# EAGLE design Aux_Power_Board (EAGLE 8.6.3)

## Sheet 1 of 2
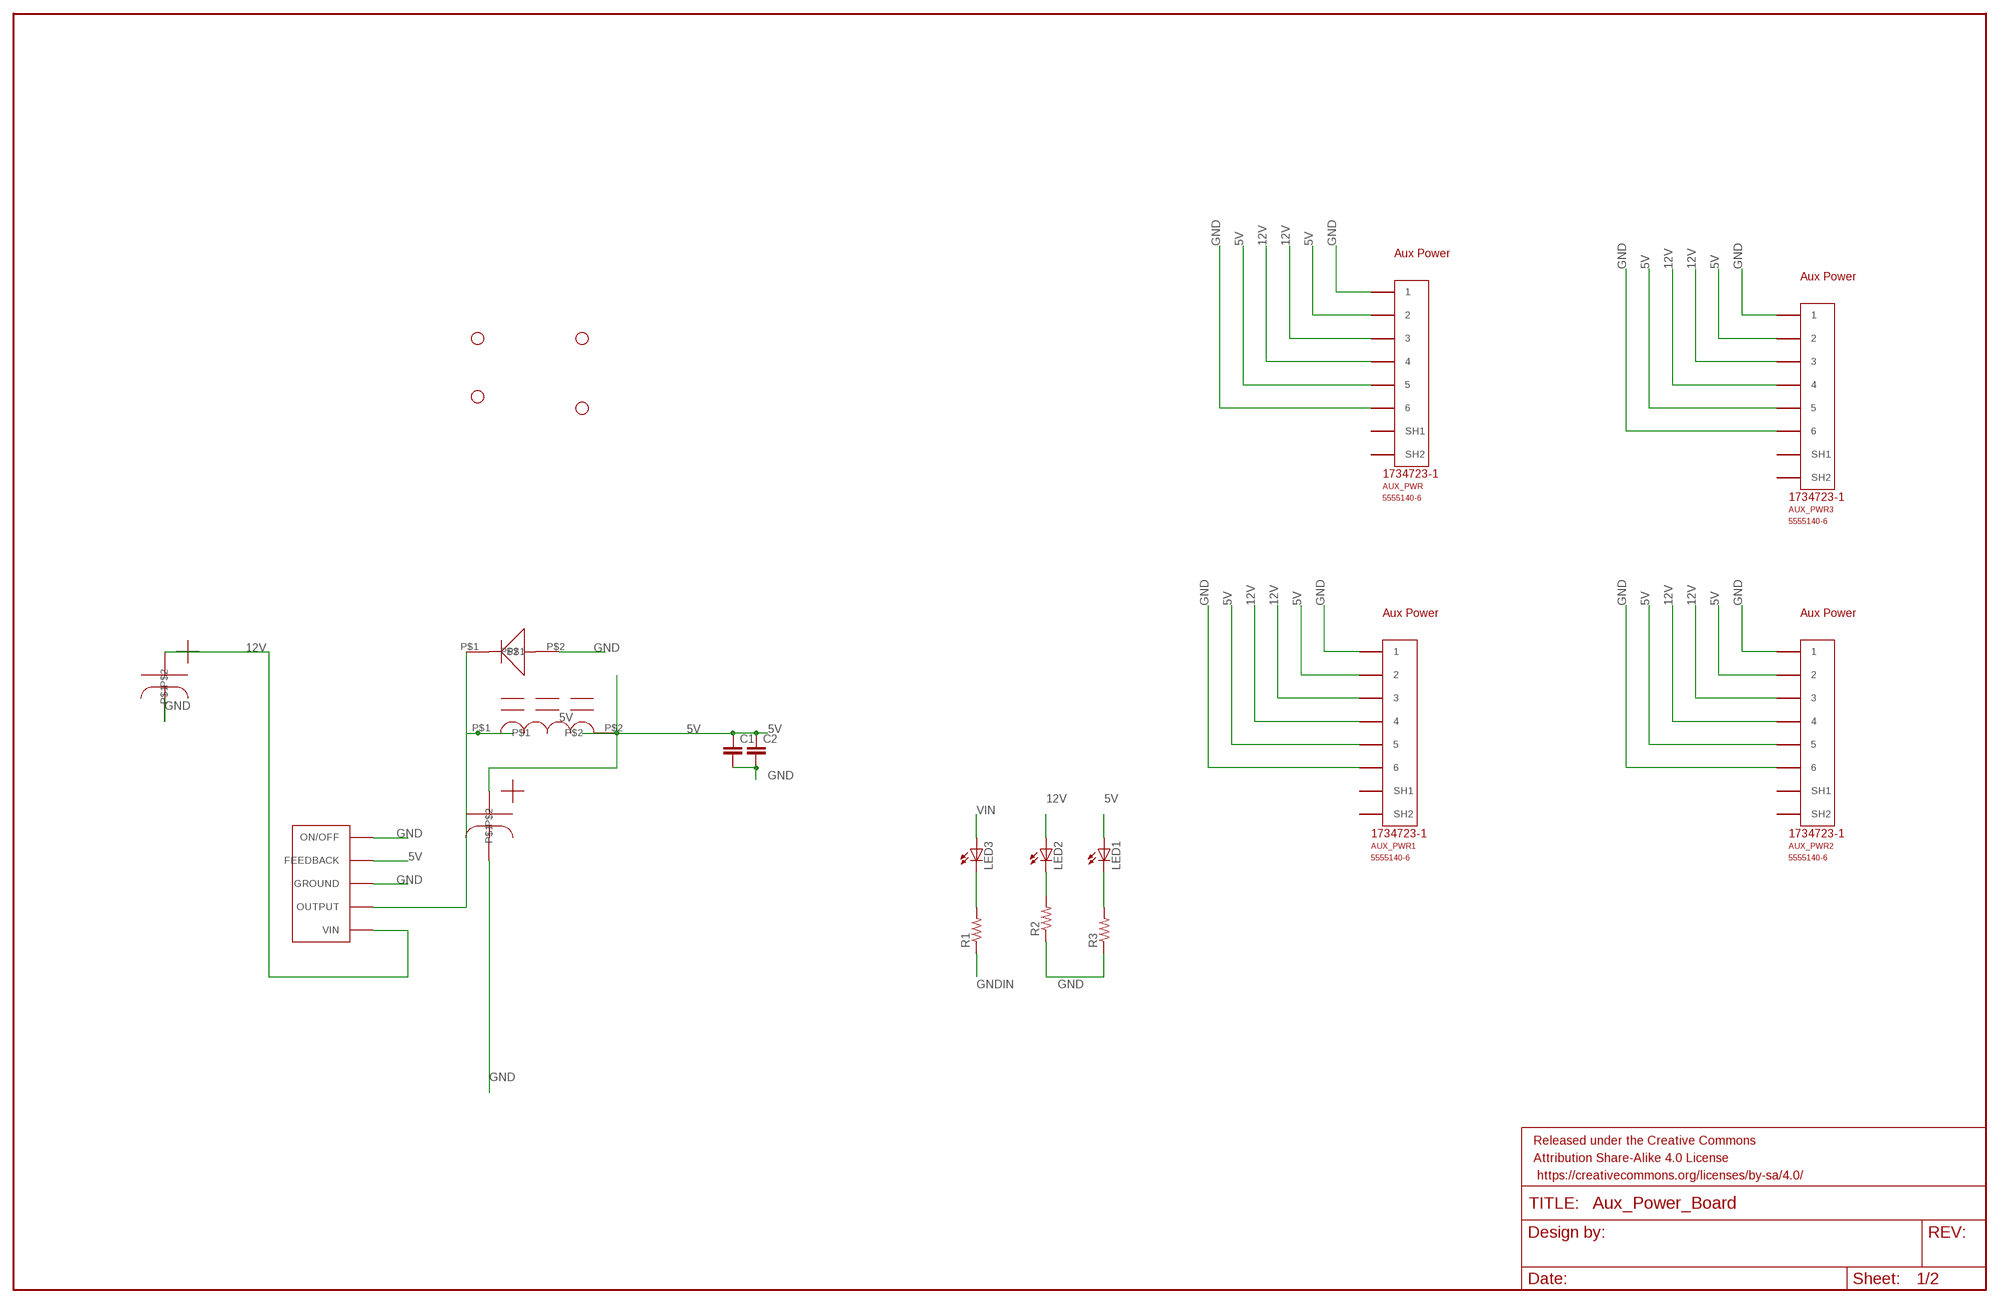
[diagram p0: schematic, sheet 1]

### Parts
AUX_PWR  5555140-6  [1734723-1_RJ11]
AUX_PWR1  5555140-6  [1734723-1_RJ11]
AUX_PWR2  5555140-6  [1734723-1_RJ11]
AUX_PWR3  5555140-6  [1734723-1_RJ11]
C1  CAP0805  [0805]
C2  CAP0805  [0805]
FRAME1  FRAME-LEDGER  [CREATIVE_COMMONS]
H1  STAND-OFF  [STAND-OFF]
H2  STAND-OFF  [STAND-OFF]
H3  STAND-OFF  [STAND-OFF]
H4  STAND-OFF  [STAND-OFF]
LED1  LEDCHIP-LED0805  [CHIP-LED0805]
LED2  LEDCHIP-LED0805  [CHIP-LED0805]
LED3  LEDCHIP-LED0805  [CHIP-LED0805]
R1  R-US_M0805  [M0805]
R2  R-US_M0805  [M0805]
R3  R-US_M0805  [M0805]
U$4  MBR360GOS  [MBR360GOS]
U$7  LM2576  [D2PAK-5]
U$8  CAPESK107M025AC3AA  [ESK107M025AC3AA]
U$9  CAPESK108M025AH4EA  [ESK108M025AH4EA]
U$10  M1418-ND  [M1418-ND]

### Nets
5V: AUX_PWR1.2 AUX_PWR1.5 AUX_PWR2.2 AUX_PWR2.5 AUX_PWR3.2 AUX_PWR3.5 AUX_PWR.2 AUX_PWR.5 C1.1 C2.1 LED1.A U$7.4(FEEDBACK) U$9.P$1 U$10.P$2 ; also sheet 2
12V: AUX_PWR1.3 AUX_PWR1.4 AUX_PWR2.3 AUX_PWR2.4 AUX_PWR3.3 AUX_PWR3.4 AUX_PWR.3 AUX_PWR.4 LED2.A U$7.1(VIN) U$8.P$1 ; also sheet 2
GND: AUX_PWR1.1 AUX_PWR1.6 AUX_PWR2.1 AUX_PWR2.6 AUX_PWR3.1 AUX_PWR3.6 AUX_PWR.1 AUX_PWR.6 C1.2 C2.2 R2.1 R3.1 U$4.P$2 U$7.3(GROUND) U$7.5(ON/OFF) U$7.GROUND U$8.P$2 U$9.P$2 ; also sheet 2
GNDIN: R1.1 ; also sheet 2
N$1: U$4.P$1 U$7.2(OUTPUT) U$10.P$1
N$3: LED3.C R1.2
N$6: LED2.C R2.2
N$9: LED1.C R3.2
VIN: LED3.A ; also sheet 2
Unconnected: AUX_PWR1.SH1 AUX_PWR1.SH2 AUX_PWR2.SH1 AUX_PWR2.SH2 AUX_PWR3.SH1 AUX_PWR3.SH2 AUX_PWR.SH1 AUX_PWR.SH2

### Notes on the sheet
- Aux Power
- Aux Power
- Aux Power | Aux Power

## Sheet 2 of 2
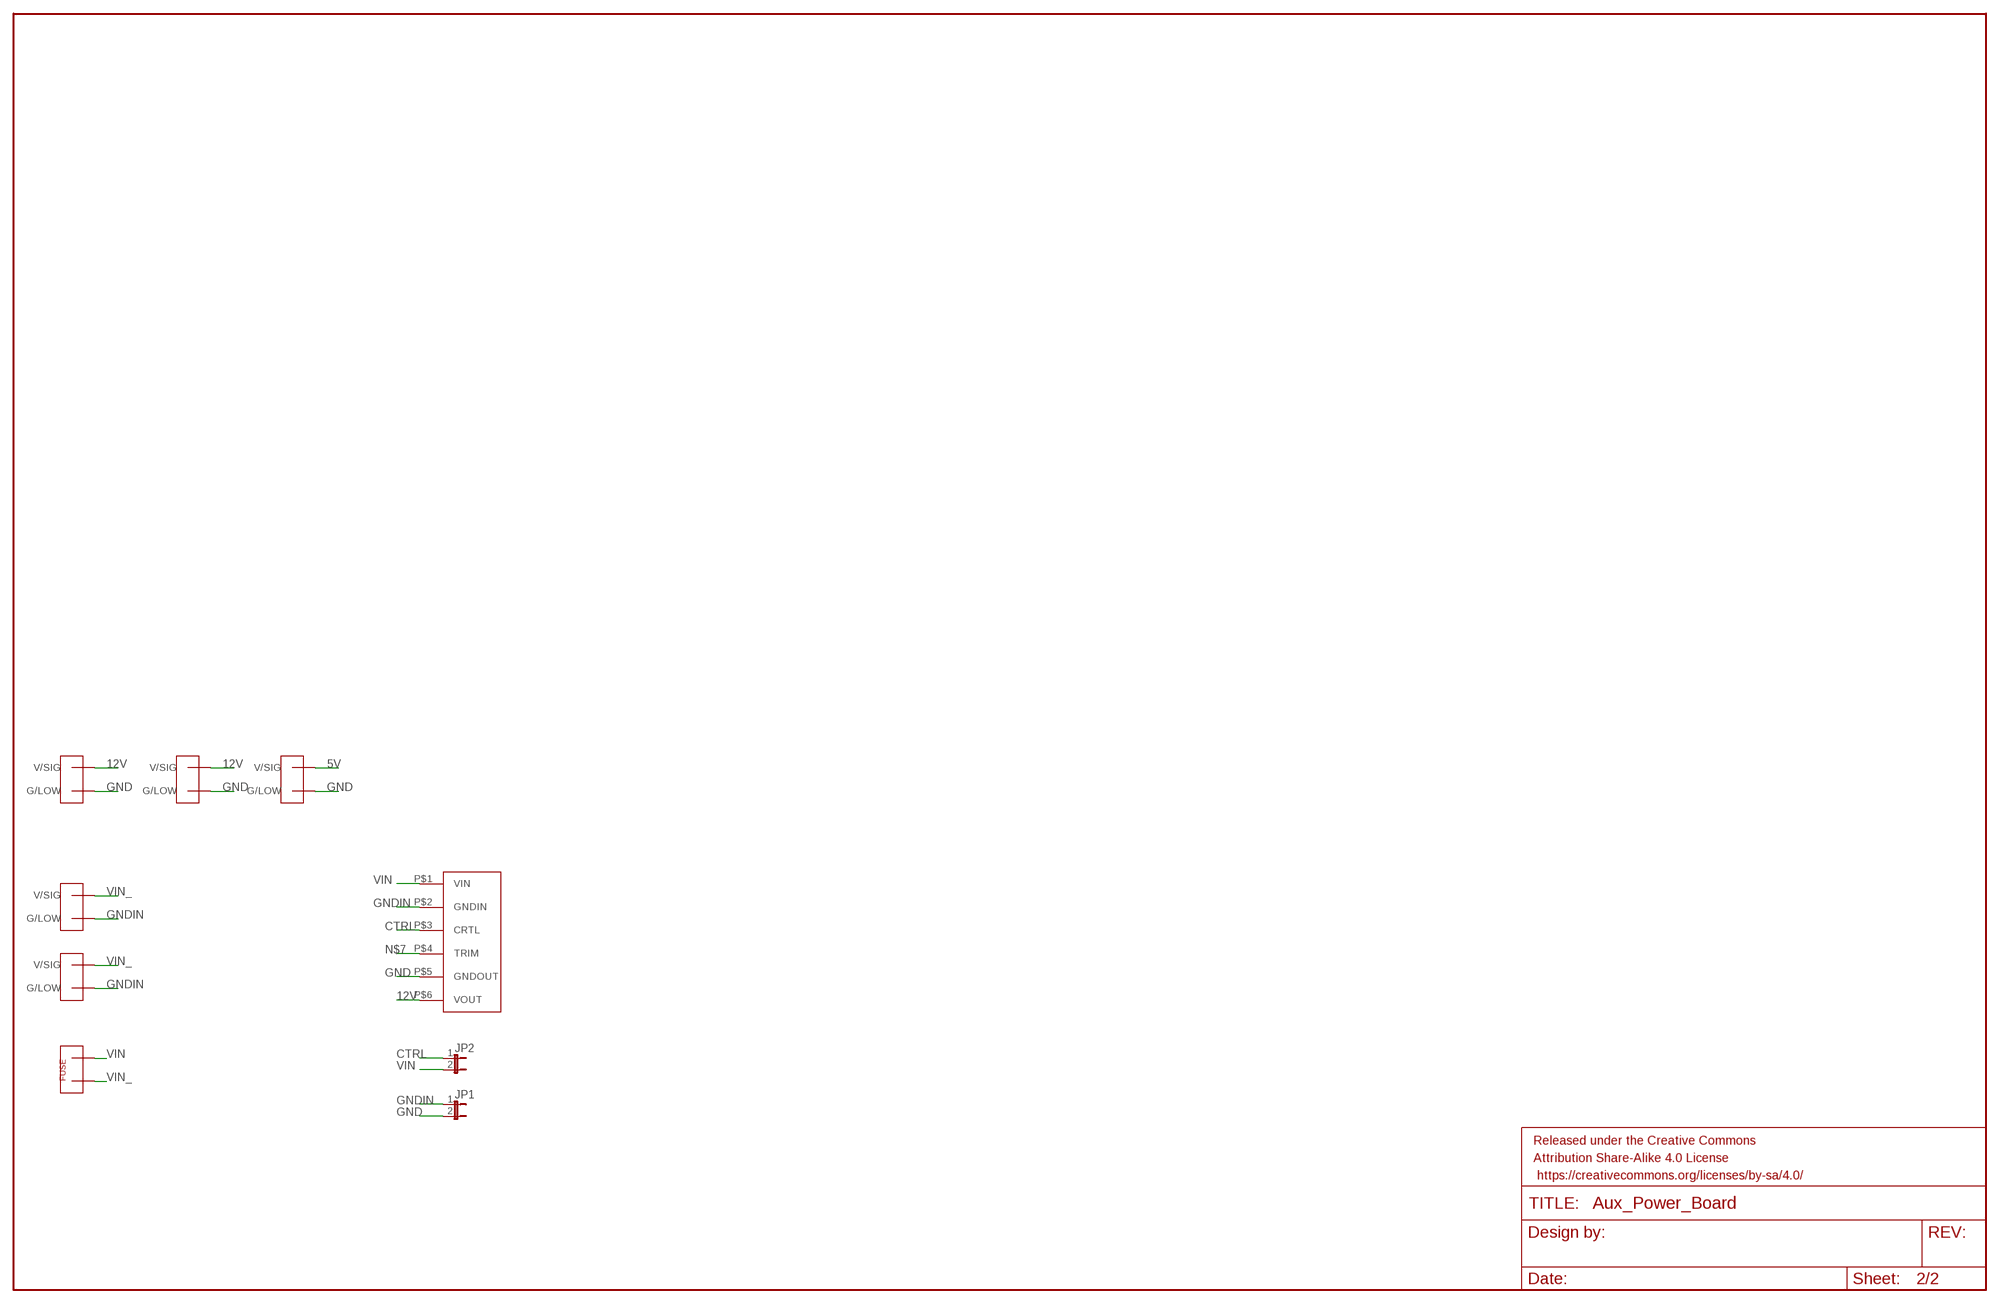
[diagram p1: schematic, sheet 2]

### Parts
FRAME2  FRAME-LEDGER  [CREATIVE_COMMONS]
JP1  JP1E  [JP1]
JP2  JP1E  [JP1]
U$1  TE770966  [2X1-MATE-N-LOCK]
U$2  TE770966  [2X1-MATE-N-LOCK]
U$3  TE770966  [2X1-MATE-N-LOCK]
U$12  RPA60-2412SFW_P  [RPA60-2412SFW/P]
U$13  FUSEMINI-BLADE  [MINI-BLADE-FUSE]
U$14  TE770966  [2X1-MATE-N-LOCK]
U$15  TE770966  [2X1-MATE-N-LOCK]

### Nets
5V: U$3.CIRCUIT1(V/SIG) ; also sheet 1
12V: U$1.CIRCUIT1(V/SIG) U$2.CIRCUIT1(V/SIG) U$12.P$6(VOUT) ; also sheet 1
CTRL: JP2.1 U$12.P$3(CRTL)
GND: JP1.2 U$1.CIRCUIT2(G/LOW) U$2.CIRCUIT2(G/LOW) U$3.CIRCUIT2(G/LOW) U$12.P$5(GNDOUT) ; also sheet 1
GNDIN: JP1.1 U$12.P$2(GNDIN) U$14.CIRCUIT2(G/LOW) U$15.CIRCUIT2(G/LOW) ; also sheet 1
N$7: U$12.P$4(TRIM)
VIN: JP2.2 U$12.P$1(VIN) U$13.OUT ; also sheet 1
VIN_: U$13.IN U$14.CIRCUIT1(V/SIG) U$15.CIRCUIT1(V/SIG)

## Library data of the parts
AUX_PWR AUX_PWR1-AUX_PWR3 = 5555140-6 RJ11:5555140-6
C1 C2 = E-P-099-R2.2:CAP: Capacitor Standard 0603 ceramic capacitor, and 0.1" leaded capacitor.
FRAME1 FRAME2 = SparkFun-Aesthetics:FRAME-LEDGER: Schematic Frame - Ledger Standard 11x14 US Ledger frame
H1-H4 = SparkFun-Electromechanical:STAND-OFF: #4 Stand Off This is the mechanical footprint for a #4 phillips button head screw. Use the keepout ring to avoid running the screw head into surrounding components. SKU : PRT-00447
JP1 JP2 = jumper:JP1E: JUMPER
LED1-LED3 = led:LED: LED OSRAM: - CHIPLED LG R971, LG N971, LY N971, LG Q971, LY Q971, LO R971, LY R971 LH N974, LH R974 LS Q976, LO Q976, LY Q976 LO Q996 - Hyper CHIPLED LW Q18S LB Q993, LB Q99A, LB R99A - SideLED LS A670, LO A670, LY A670, LG A670, LP A670 LB A673, LV A673, LT A673, LW A673 LH A674 LY A675 LS A676, LA A676, LO A676, LY A676, LW A676 LS A679, LY A679, LG A679 - Hyper Micro SIDELED® LS Y876, LA Y876, LO Y876, LY Y876 LT Y87S - SmartLED LW L88C, LW L88S LB L89C, LB L89S, LG L890 LS L89K, LO L89K, LY L89K LS L896, LA L896, LO L896, LY L896 - TOPLED LS T670, LO T670, LY T670, LG T670, LP T670 LSG T670, LSP T670, LSY T670, LOP T670, LYG T670 LG T671, LOG T671, LSG T671 LB T673, LV T673, LT T673, LW T673 LH T674 LS T676, LA T676, LO T676, LY T676, LB T676, LH T676, LSB T676, LW T676 LB T67C, LV T67C, LT T67C, LS T67K, LO T67K, LY T67K, LW E67C LS E67B, LA E67B, LO E67B, LY E67B, LB E67C, LV E67C, LT E67C LW T67C LS T679, LY T679, LG T679 LS T770, LO T770, LY T770, LG T770, LP T770 LB T773, LV T773, LT T773, LW T773 LH T774 LS E675, LA E675, LY E675, LS T675 LS T776, LA T776, LO T776, LY T776, LB T776 LHGB T686 LT T68C, LB T68C - Hyper Mini TOPLED® LB M676 - Mini TOPLED Santana® LG M470 LS M47K, LO M47K, LY M47K Source: http://www.osram.convergy.de LUXEON: - LUMILED® LXK2-PW12-R00, LXK2-PW12-S00, LXK2-PW14-U00, LXK2-PW14-V00 LXK2-PM12-R00, LXK2-PM12-S00, LXK2-PM14-U00 LXK2-PE12-Q00, LXK2-PE12-R00, LXK2-PE12-S00, LXK2-PE14-T00, LXK2-PE14-U00 LXK2-PB12-K00, LXK2-PB12-L00, LXK2-PB12-M00, LXK2-PB14-N00, LXK2-PB14-P00, LXK2-PB14-Q00 LXK2-PR12-L00, LXK2-PR12-M00, LXK2-PR14-Q00, LXK2-PR14-R00 LXK2-PD12-Q00, LXK2-PD12-R00, LXK2-PD12-S00 LXK2-PH12-R00, LXK2-PH12-S00 LXK2-PL12-P00, LXK2-PL12-Q00, LXK2-PL12-R00 Source: www.luxeon.com KINGBRIGHT: KA-3528ASYC Source: www.kingbright.com
R1-R3 = rcl:R-US_: RESISTOR, American symbol; SPICEPREFIX: R
U$1-U$3 U$14 U$15 = Shell2013(1):TE770966
U$4 = Shell2013:MBR360GOS
U$7 = Shell2015:LM2576
U$8 U$9 = Shell2015:CAP
U$10 = Shell2015:M1418-ND: 100uF inductor
U$12 = RPA60-2412SFW_P:RPA60-2412SFW_P
U$13 = Shell2013:FUSE

## Board
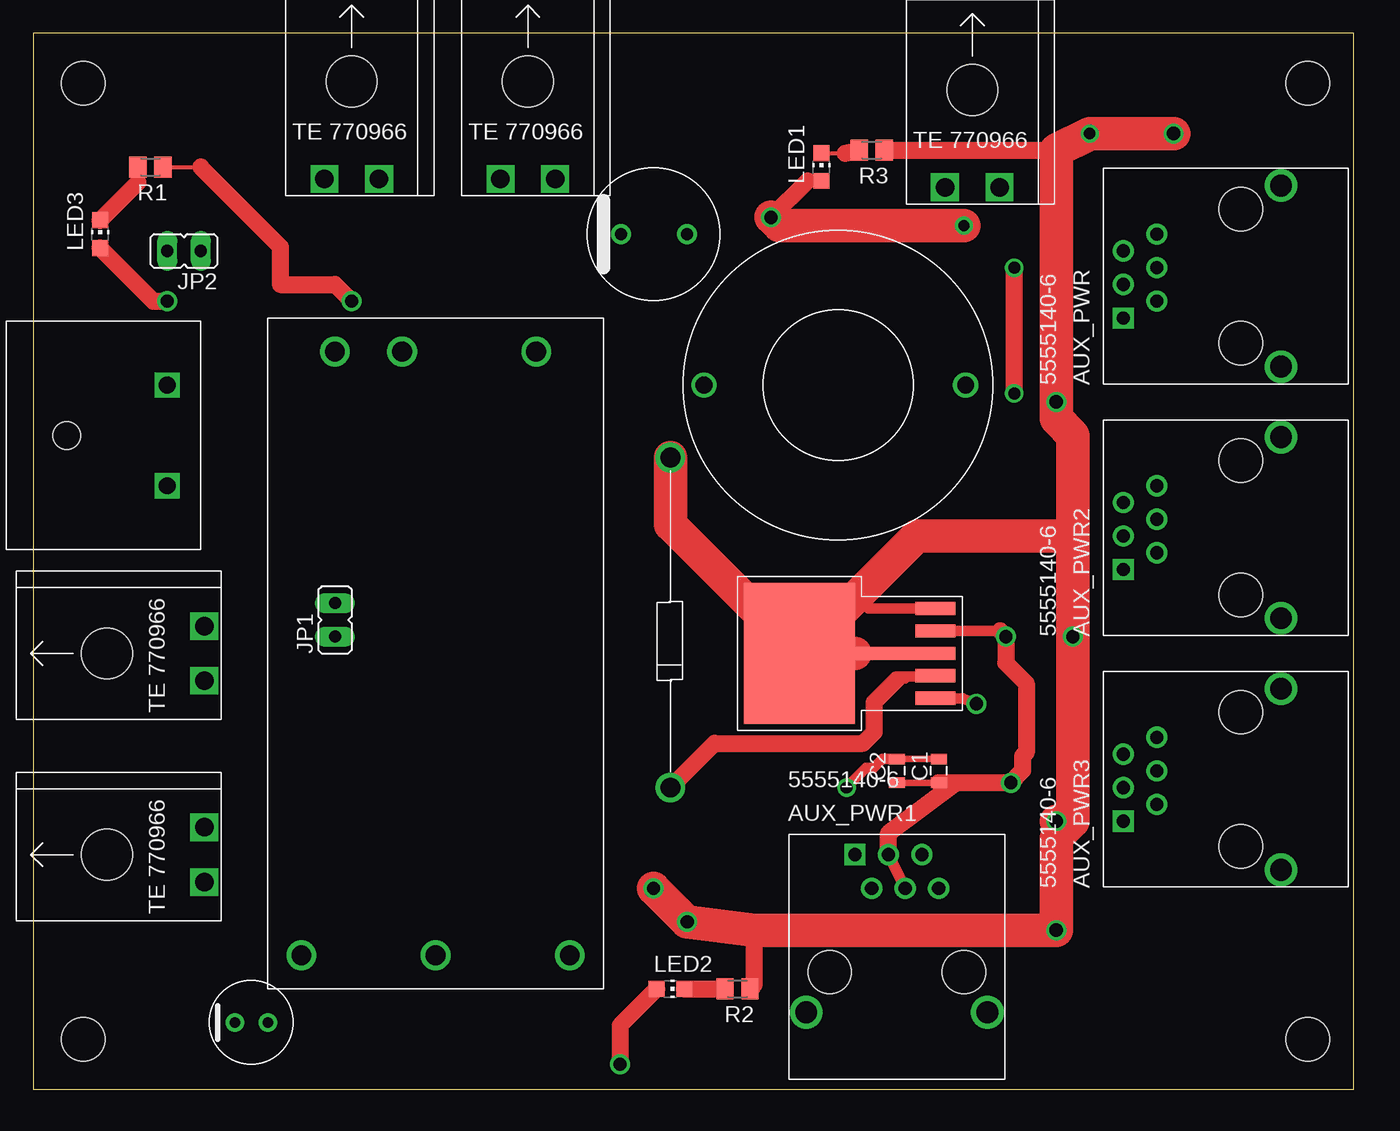
[diagram p2: board, top side]
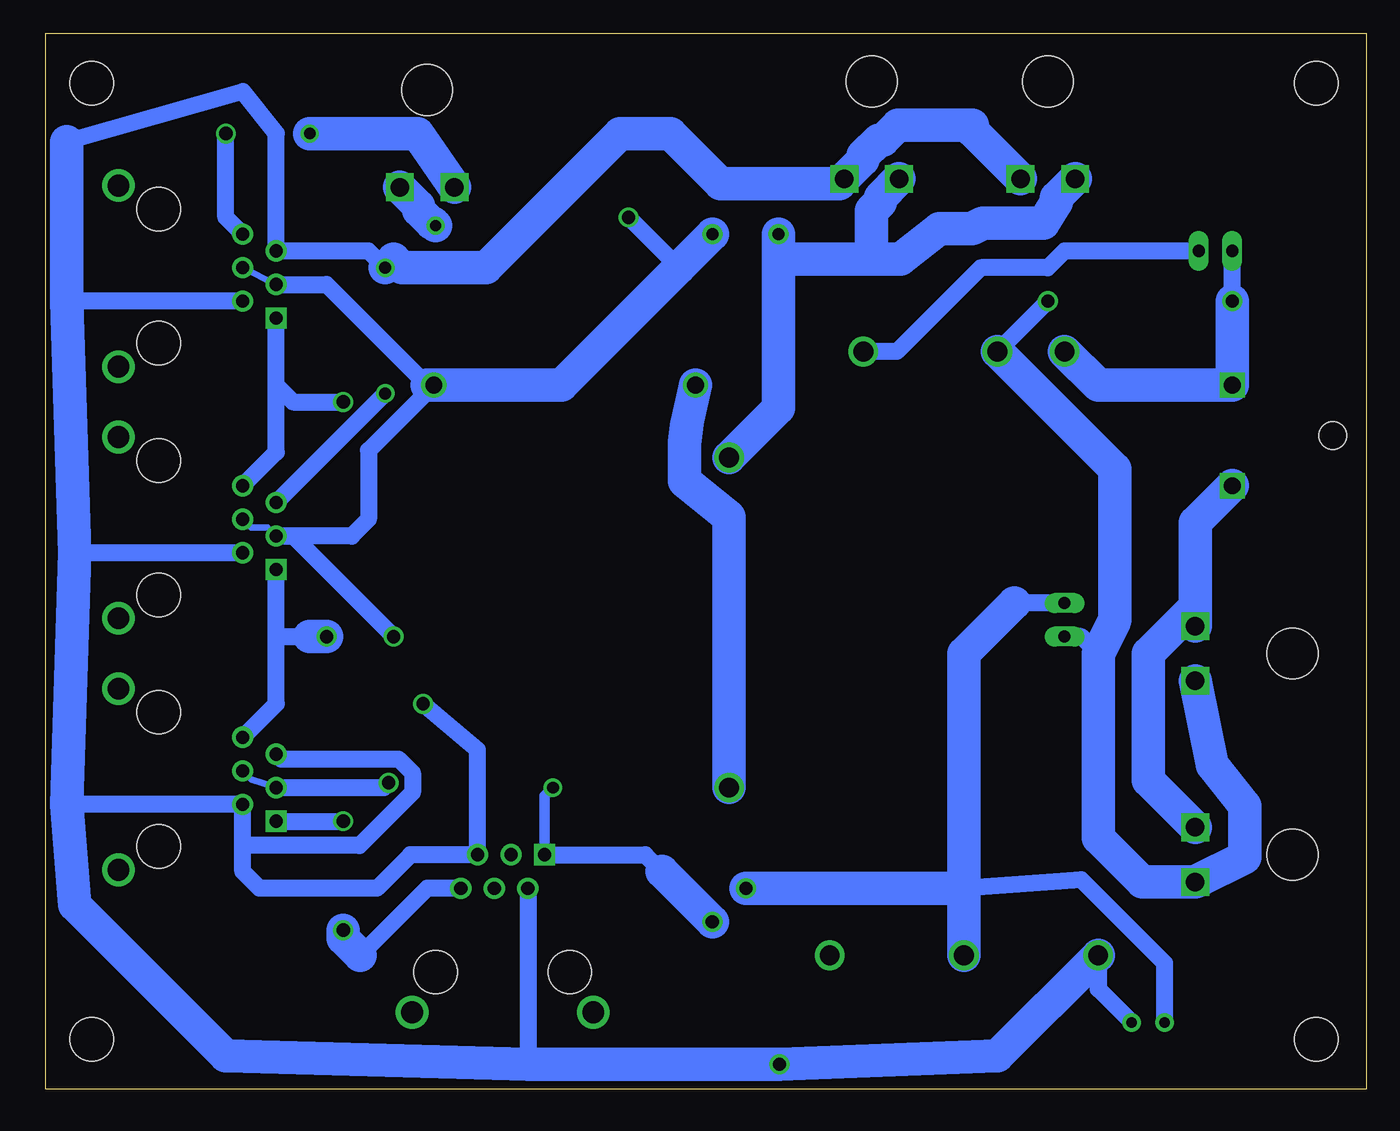
[diagram p3: board, bottom side, seen from below]

Size 100 x 80 mm. Coordinates in mm from the lower left corner, seen from the top.
Outline: 0,0 100,0 100,80 0,80 0,0
Copper layers (1*16): Top 0.035mm / dielectric 1.5mm / Bottom 0.035mm
Design rules "SparkFun *": minimum track width 8mil, minimum drill 20mil, track to track 16mil, track to pad 16mil, pad to pad 16mil, via to via 16mil, smd to smd 16mil, copper to edge 10mil, drill to drill 8mil, minimum pad ring 12mil, minimum via ring 10mil, stop-mask expansion 4mil, vias tented up to drill 25mil, thermal gap 10mil

### Footprints (pad centres in the part's own frame; a part is rotated, then mirrored left to right if it is on the bottom)
1734723-1_RJ11 = drill 1 square: 1 -3.81,2.54 | drill 1: 2 -1.27,2.54; 3 1.27,2.54; 4 -2.54,0; 5 0,0; 6 2.54,0 | drill 1.65: SH1 -7.5,-9.4; SH2 6.22,-9.4 | hole 3.3: -5.72,-6.35; 4.44,-6.35
0805 = smd 0.8 x 1.2: 1 -0.9,0; 2 0.9,0
STAND-OFF = hole 3.302: 0,0
JP1 = drill 0.914 long: 1 0,-1.27; 2 0,1.27
CHIP-LED0805 = smd 1.2 x 1.2: A 0,-1.05; C 0,1.05
M0805 = smd 1.3 x 1.6: 1 -0.95,0; 2 0.95,0
2X1-MATE-N-LOCK = drill 1.4 square: CIRCUIT1 -2.07,14.23; CIRCUIT2 2.07,14.23 | hole 3.86: 0,6.86
MBR360GOS = drill 1.5: P$1 0,0; P$2 25,0
D2PAK-5 = smd 3.048 x 1.016: 1 6.096,-3.404; 2 6.096,-1.702; 4 6.096,1.702; 5 6.096,3.404 | smd 7.62 x 1.016: 3 3.81,0 | smd 8.382 x 10.668: GROUND -4.191,0
ESK107M025AC3AA = drill 0.8: P$1 0,0; P$2 2.5,0
ESK108M025AH4EA = drill 0.9: P$1 0,0; P$2 5,0
M1418-ND = drill 1.27: P$1 0,0; P$2 19.812,0
RPA60-2412SFW/P = drill 1.5: P$1 0,0; P$2 0,5.08; P$3 0,15.24; P$4 45.72,17.78; P$5 45.72,7.62; P$6 45.72,-2.54
MINI-BLADE-FUSE = drill 1.27 square: IN 3.81,7.62; OUT -3.81,7.62 | hole 2.083: 0,0

### Placement (x,y rotation side)
AUX_PWR  85.09,62.23 90 top
AUX_PWR1  66.04,15.24 0 top
AUX_PWR2  85.09,43.18 90 top
AUX_PWR3  85.09,24.13 90 top
C1  68.58,24.13 90 top
C2  65.41,24.13 90 top
FRAME1  19.05,-14.61 0 top  (outside the outline)
FRAME2  19.05,-23.5 0 top  (outside the outline)
H1  3.81,3.81 0 top
H2  3.81,76.2 0 top
H3  96.52,3.81 0 top
H4  96.52,76.2 0 top
JP1  22.86,35.56 0 top
JP2  11.43,63.5 90 top
LED1  59.69,69.85 0 top
LED2  48.26,7.62 270 top
LED3  5.08,64.77 0 top
R1  8.89,69.85 180 top
R2  53.34,7.62 180 top
R3  63.5,71.12 180 top
U$1  24.13,83.19 180 top
U$2  37.47,83.19 180 top
U$3  71.12,82.55 180 top
U$4  48.26,22.86 90 top
U$7  62.23,33.02 0 top
U$8  17.78,5.08 180 top
U$9  49.53,64.77 180 top
U$10  50.8,53.34 0 top
U$12  22.86,55.88 270 top
U$13  2.54,49.53 270 top
U$14  -1.27,17.78 270 top
U$15  -1.27,33.02 270 top

### Tracks (layer width: path | path; a pad name or v marks a point on that pad's centre or on a via)
5V  (via drill 0.85, 1)
  Top 0.305: LED1.A 58.64,68.8
  Top 0.508: C2.1 C1.1
  Top 0.813: 73.23,34.72 U$7.4 | AUX_PWR1.5 AUX_PWR1.2
  Top 1.27: 73.23,34.72 v73.66,34.29 73.66,32.3 75.21,30.75 75.21,25.5 74.93,25.22 74.93,24.13 v74.03,23.23 69.85,23.23 | 69.85,23.23 C1.1 | AUX_PWR1.2 64.77,19.42 69.85,23.23 | 58.64,68.8 v55.88,66.04
  Top 2.54: v70.48,65.41 56.52,65.41 v55.88,66.04
  Bottom 0.508: AUX_PWR.5 AUX_PWR.2 | AUX_PWR3.5 84.45,23.5 AUX_PWR3.2 | AUX_PWR2.2 83.19,42.55 84.45,42.55 AUX_PWR2.5
  Bottom 1.27: AUX_PWR.2 78.74,60.96 71.12,53.34 U$10.P$2 75.56,48.39 75.56,43.18 76.83,41.91 AUX_PWR2.2 81.28,41.91 v73.66,34.29 | AUX_PWR3.2 74.4,22.86 v74.03,23.23 | v55.88,66.04 52.07,62.23
  Bottom 2.54: U$9.P$1 52.07,62.23 60.96,53.34 71.12,53.34 | U$3.CIRCUIT1 71.78,66.91 71.78,66.58 70.79,65.59 70.67,65.59 v70.48,65.41
12V  (via drill 0.9, 1)
  Top 0.813: v71.43,29.21 70.39,29.62 U$7.1
  Top 1.27: LED2.A 44.45,4.86 v44.45,1.91 | v74.3,52.7 v74.3,62.23
  Bottom 1.27: AUX_PWR1.4 63.5,1.91 | 85.09,18.41 85.09,16.51 83.82,15.24 74.93,15.24 72.39,17.78 AUX_PWR1.3 67.31,25.72 v71.43,29.21 | 85.09,18.41 AUX_PWR3.4 98.42,21.59 | U$12.P$6 20.32,7.62 U$8.P$1 | AUX_PWR2.4 97.79,40.64 | AUX_PWR.4 98.42,59.69 | 98.42,71.75 85.09,75.56 82.55,72.39 AUX_PWR.3 75.56,63.5 v74.3,62.23 | AUX_PWR3.3 82.17,25.02 73.29,25.02 72.23,23.97 72.23,22.49 76.25,18.47 85.03,18.47 85.09,18.41 | AUX_PWR2.3 v74.3,52.7
  Bottom 2.54: U$12.P$6 27.94,2.54 v44.45,1.91 63.5,1.91 86.36,2.54 97.79,13.97 98.42,21.59 97.79,40.64 98.42,59.69 98.42,71.75 | U$1.CIRCUIT1 29.84,72.6 29.84,73.03 35.49,73.03 36.62,71.9 36.92,71.9 38.12,70.7 38.12,70.39 39.55,68.97 U$2.CIRCUIT1 39.91,68.58 48.9,68.58 52.7,72.39 56.52,72.39 66.67,62.23 73.03,62.23 73.66,62.87 v74.3,62.23
CTRL
  Bottom 1.27: JP2.1 22.86,63.5 24.13,62.23 29.21,62.23 35.56,55.88 U$12.P$3
GND  (via drill 0.85, 0.9, 1)
  Top 0.508: C1.2 C2.2 | U$7.3 62.23,33.02
  Top 0.813: U$7.3 66.24,33.02 | U$7.5 63.27,36.42 62.36,37.34 | v61.59,22.86 63.07,24.33 63.62,24.33 64.32,25.03 C2.2
  Top 1.27: R3.1 77.47,71.12 | R2.1 54.61,7.94 54.61,12.06
  Top 2.54: v46.99,15.24 v49.53,12.7 54.61,12.06 v77.47,12.06 77.47,19.05 78.74,20.32 | v86.36,72.39 v80.01,72.39 77.47,71.12 v77.47,52.07 77.47,50.8 78.74,49.53 78.74,41.91 | 78.74,20.32 v78.74,34.29 78.74,41.91 | 78.74,20.32 v77.47,20.32 | U$7.GROUND 48.26,42.8 U$4.P$2 | 62.23,33.02 U$7.GROUND | 78.74,41.91 66.93,41.91 62.36,37.34 U$7.GROUND
  Bottom 0.813: AUX_PWR1.1 62.23,22.23 v61.59,22.86
  Bottom 1.27: JP1.2 26.67,36.83 | U$8.P$2 15.28,9.56 21.59,15.88 30.48,15.24 | AUX_PWR3.1 v77.47,20.32 | AUX_PWR1.6 71.12,15.24 76.2,10.16 | AUX_PWR1.1 54.61,17.78 53.34,16.51 | AUX_PWR3.6 82.55,29.21 82.55,34.29 | 82.55,34.29 AUX_PWR2.1 | 82.55,34.29 80.01,34.29 | AUX_PWR2.6 82.55,48.26 82.55,53.34 | 82.55,53.34 AUX_PWR.1 | 82.55,53.34 81.28,52.07 v77.47,52.07 | AUX_PWR.6 86.36,66.04 v86.36,72.39
  Bottom 2.54: 26.67,36.83 30.48,33.02 30.48,15.24 | 30.48,15.24 U$12.P$5 | 30.48,15.24 v46.99,15.24 | 80.01,34.29 v78.74,34.29 | 76.2,10.16 77.47,11.43 v77.47,12.06 | 53.34,16.51 v49.53,12.7 | U$9.P$2 44.53,62.87 | 44.53,62.87 44.53,51.59 U$4.P$2 | U$1.CIRCUIT2 23.47,67.54 23.47,67.21 24.46,65.59 29.04,65.59 29.89,65.18 32.34,65.18 35.28,62.87 37.47,62.87 | 37.47,62.87 44.53,62.87 | U$2.CIRCUIT2 36.81,67.54 36.81,67.21 37.47,66.55 37.47,62.87 | U$3.CIRCUIT2 71.85,72.39 v80.01,72.39
GNDIN  (via drill 1)
  Top 0.305: R1.1 12.7,69.85
  Top 1.27: v24.13,59.69 22.86,60.96 18.73,60.96 18.73,63.82 12.7,69.85
  Bottom 1.27: 20.32,33.02 21.59,34.29 JP1.1 | v24.13,59.69 U$12.P$2
  Bottom 2.54: U$15.CIRCUIT2 11.69,24.6 9.22,21.49 9.22,17.58 12.96,15.74 U$14.CIRCUIT2 16.98,15.71 20.32,19.05 20.32,33.02 19.05,35.56 19.05,46.99 U$12.P$2
N$1
  Top 0.813: 65.48,31.11 65.63,31.27 66.19,31.27 | 65.41,31.04 65.48,31.11 | 65.48,31.11 66.03,31.11 66.19,31.27 | U$7.2 68.28,31.27 66.19,31.27
  Top 1.27: U$4.P$1 51.61,26.21 62.84,26.21 63.7,27.08 63.7,29.34 65.41,31.04
  Bottom 2.54: U$10.P$1 51.44,50.47 51.64,49 51.64,46.09 48.26,43.35 U$4.P$1
N$3
  Top 0.305: 7.94,68.68 R1.2
  Top 1.27: LED3.C 7.94,68.68
N$6
  Top 1.27: LED2.C R2.2
N$9
  Top 0.305: LED1.C 61.5,70.9
  Top 1.27: 61.5,70.9 R3.2
VIN  (via drill 1)
  Top 1.27: LED3.A 9.11,59.69 v10.16,59.69
  Bottom 1.27: v10.16,59.69 JP2.2
  Bottom 2.54: U$12.P$1 20.32,53.34 U$13.OUT v10.16,59.69
VIN_
  Bottom 2.54: U$13.IN 12.96,42.92 U$15.CIRCUIT1 13.17,36.36 16.51,33.02 16.51,23.4 U$14.CIRCUIT1